# EAGLE design usbspi v1.0 (EAGLE 4.13)
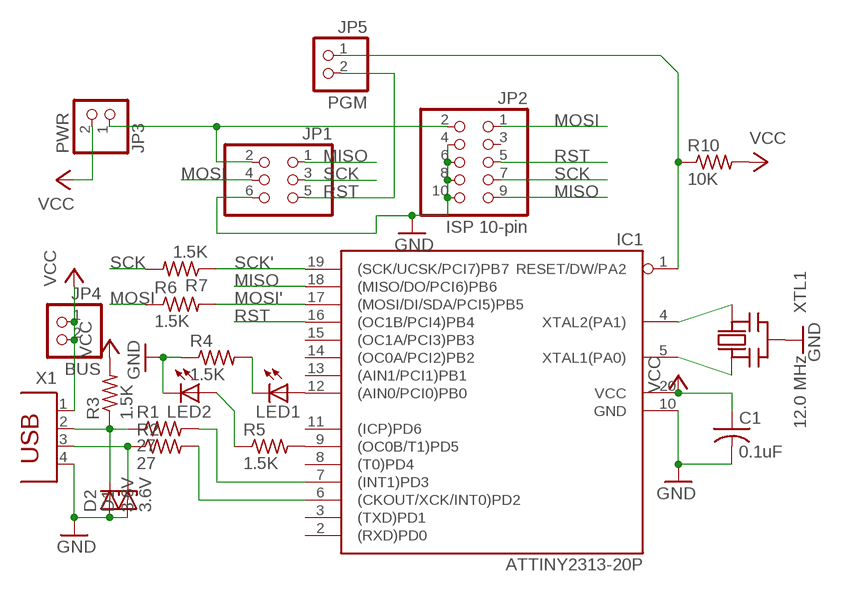
[diagram p0: schematic, sheet 1]

## Parts
C1  0.1uF  C-US025-025X050  [C025-025X050]
D1  3.6V  ZENER-DIODEDO35Z10  [DO35Z10]
D2  3.6V  ZENER-DIODEDO35Z10  [DO35Z10]
IC1  ATTINY2313-20P  [DIL20]
JP1  PINHD-2X3  [2X03]
JP2  ISP 10-pin  PINHD-2X5  [2X05]
JP3  PWR  PINHD-1X2  [1X02]
JP4  BUS  PINHD-1X2  [1X02]
JP5  PGM  PINHD-1X2  [1X02]
LED1  LED3MM  [LED3MM]
LED2  LED3MM  [LED3MM]
R1  27  R-US_0207/10  [0207/10]
R2  27  R-US_0207/10  [0207/10]
R3  1.5K  R-US_0207/10  [0207/10]
R4  1.5K  R-US_0207/5V  [0207/5V]
R5  1.5K  R-US_0207/10  [0207/10]
R6  1.5K  R-US_0207/5V  [0207/5V]
R7  1.5K  R-US_0207/5V  [0207/5V]
R10  10K  R-US_0207/5V  [0207/5V]
X1  PN61729  [PN61729]
XTL1  12.0 MHz  CERMOSCILL  [CERM_OSC]

## Nets
GND: C1.2 D1.A D2.A IC1.10(GND) JP1.6 JP2.4 JP2.6 JP2.8 JP2.10 LED2.K(C) R4.1 X1.4 XTL1.P$2(GND)
MISO: IC1.18((MISO/DO/PCI6)PB6) JP1.1 JP2.9
MOSI: JP1.4 JP2.1 R6.1
MOSI': IC1.17((MOSI/DI/SDA/PCI5)PB5) R6.2
N$1: D2.C R1.1 R3.1 X1.2
N$2: D1.C R2.1 X1.3
N$3: IC1.7((INT1)PD3) R1.2
N$4: IC1.5(XTAL1(PA0)) XTL1.P$3(OUT)
N$5: IC1.4(XTAL2(PA1)) XTL1.P$1(IN)
N$6: IC1.6((CKOUT/XCK/INT0)PD2) R2.2
N$7: IC1.12((AIN0/PCI0)PB0) LED1.A
N$8: LED1.K(C) R4.2
N$9: IC1.1(RESET/DW/PA2) JP5.1 R10.1
N$10: IC1.9((OC0B/T1)PD5) R5.2
N$11: LED2.A R5.1
N$14: JP1.2 JP2.2 JP3.1
RST: IC1.16((OC1B/PCI4)PB4) JP1.5 JP2.5 JP5.2
SCK: JP1.3 JP2.7 R7.2
SCK': IC1.19((SCK/UCSK/PCI7)PB7) R7.1
VCC: C1.1 IC1.20(VCC) JP3.2 JP4.1 JP4.2 R3.2 R10.2 X1.1
Unconnected: IC1.2((RXD)PD0) IC1.3((TXD)PD1) IC1.8((T0)PD4) IC1.11((ICP)PD6) IC1.13((AIN1/PCI1)PB1) IC1.14((OC0A/PCI2)PB2) IC1.15((OC1A/PCI3)PB3) JP2.3

## Library data of the parts
C1 = rcl-ez:C-US: CAPACITOR, American symbol
D1 D2 = diode:ZENER-DIODE: Z-Diode
IC1 = avr:ATTINY2313: MICROCONTROLLER 2 Kbytes FLASH 128 bytes SRAM 128 bytes EEPROM USART USI
JP1 = pinhead-ez:PINHD-2X3: PIN HEADER
JP2 = sonar:PINHD-2X5: PIN HEADER
JP3-JP5 = pinhead:PINHD-1X2: PIN HEADER
LED1 LED2 = minimidi:LED: LED OSRAM: - CHIPLED LG R971, LG N971, LY N971, LG Q971, LY Q971, LO R971, LY R971 LH N974, LH R974 LS Q976, LO Q976, LY Q976 LO Q996 - Hyper CHIPLED LW Q18S LB Q993, LB Q99A, LB R99A - SideLED LS A670, LO A670, LY A670, LG A670, LP A670 LB A673, LV A673, LT A673, LW A673 LH A674 LY A675 LS A676, LA A676, LO A676, LY A676, LW A676 LS A679, LY A679, LG A679 - Hyper Micro SIDELED® LS Y876, LA Y876, LO Y876, LY Y876 LT Y87S - SmartLED LW L88C, LW L88S LB L89C, LB L89S, LG L890 LS L89K, LO L89K, LY L89K LS L896, LA L896, LO L896, LY L896 - TOPLED LS T670, LO T670, LY T670, LG T670, LP T670 LSG T670, LSP T670, LSY T670, LOP T670, LYG T670 LG T671, LOG T671, LSG T671 LB T673, LV T673, LT T673, LW T673 LH T674 LS T676, LA T676, LO T676, LY T676, LB T676, LH T676, LSB T676, LW T676 LB T67C, LV T67C, LT T67C, LS T67K, LO T67K, LY T67K, LW E67C LS E67B, LA E67B, LO E67B, LY E67B, LB E67C, LV E67C, LT E67C LW T67C LS T679, LY T679, LG T679 LS T770, LO T770, LY T770, LG T770, LP T770 LB T773, LV T773, LT T773, LW T773 LH T774 LS E675, LA E675, LY E675, LS T675 LS T776, LA T776, LO T776, LY T776, LB T776 LHGB T686 LT T68C, LB T68C - Hyper Mini TOPLED® LB M676 - Mini TOPLED Santana® LG M470 LS M47K, LO M47K, LY M47K Source: http://www.osram.convergy.de/
R1-R7 R10 = rcl-ez:R-US_: RESISTOR, American symbol
X1 = con-berg-ez:PN61729: BERG USB connector
XTL1 = minimidi:CERMOSCILL

## Board
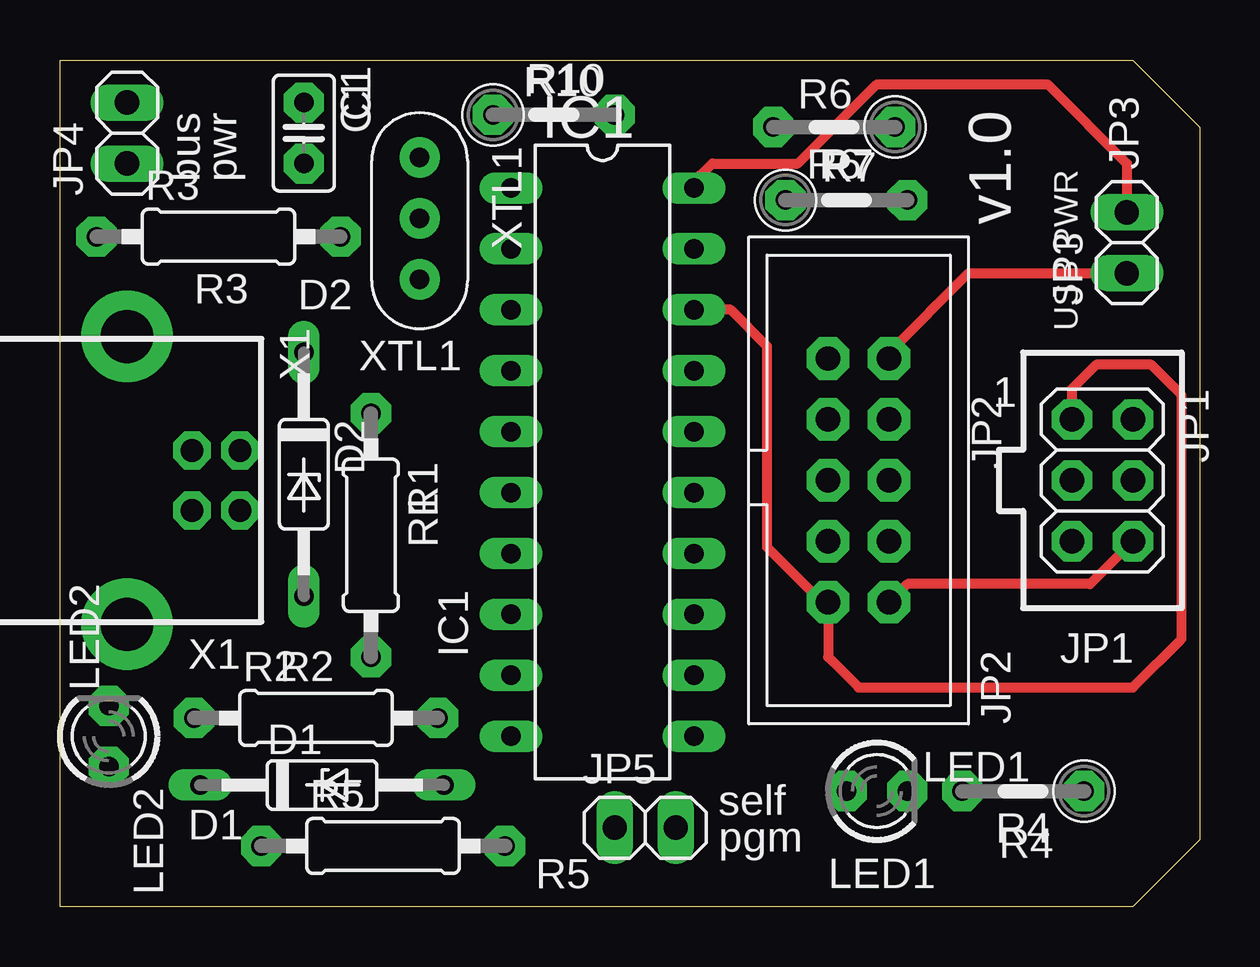
[diagram p1: board, top side]
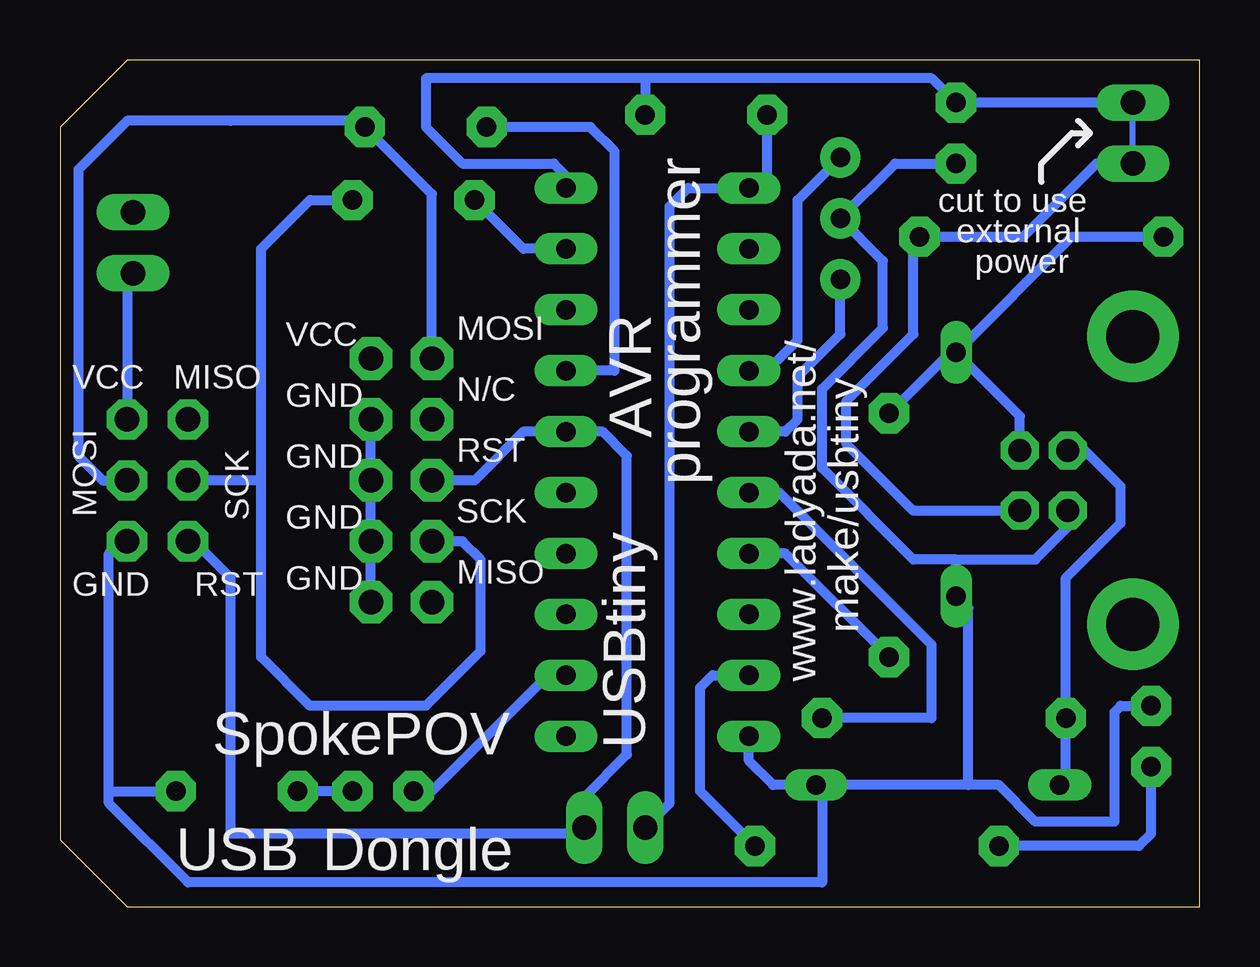
[diagram p2: board, bottom side, seen from below]

Size 47.5 x 35.31 mm. Coordinates in mm from the lower left corner, seen from the top.
Outline: 0,35.31 44.7,35.31 47.5,32.51 47.5,2.79 44.7,0 0,0 0,35.31
Copper layers (1*16): Top 0.035mm / dielectric 1.5mm / Bottom 0.035mm
Design rules "default": minimum track width 10mil, minimum drill 24mil, track to track 16mil, track to pad 16mil, pad to pad 16mil, via to via 16mil, smd to smd 0mil, copper to edge 20mil, drill to drill 8mil, minimum pad ring 10mil, minimum via ring 8mil, stop-mask expansion 4mil, vias tented up to drill 0mil, thermal gap 10mil

### Footprints (pad centres in the part's own frame; a part is rotated, then mirrored left to right if it is on the bottom)
C025-025X050 = drill 0.813 pad 1.676 octagon: 1 -1.27,0; 2 1.27,0
DO35Z10 = drill 0.813 long: A 5.08,0; C -5.08,0
DIL20 = drill 0.813 long: 1 -11.43,-3.81; 2 -8.89,-3.81; 3 -6.35,-3.81; 4 -3.81,-3.81; 5 -1.27,-3.81; 6 1.27,-3.81; 7 3.81,-3.81; 8 6.35,-3.81; 9 8.89,-3.81; 10 11.43,-3.81; 11 11.43,3.81; 12 8.89,3.81; 13 6.35,3.81; 14 3.81,3.81; 15 1.27,3.81; 16 -1.27,3.81; 17 -3.81,3.81; 18 -6.35,3.81; 19 -8.89,3.81; 20 -11.43,3.81
2X03 = drill 1.016 pad 1.676 octagon: 1 -2.54,-1.27; 2 -2.54,1.27; 3 0,-1.27; 4 0,1.27; 5 2.54,-1.27; 6 2.54,1.27
2X05 = drill 1.016 pad 1.778 octagon: 1 -5.08,-1.27; 2 -5.08,1.27; 3 -2.54,-1.27; 4 -2.54,1.27; 5 0,-1.27; 6 0,1.27; 7 2.54,-1.27; 8 2.54,1.27; 9 5.08,-1.27; 10 5.08,1.27
1X02 = drill 1.016 long: 1 -1.27,0; 2 1.27,0
LED3MM = drill 0.813 pad 1.676 octagon: A -1.27,0; K 1.27,0
0207/10 = drill 0.813 pad 1.676 octagon: 1 -5.08,0; 2 5.08,0
0207/5V = drill 0.813 pad 1.676 octagon: 1 -2.54,0; 2 2.54,0
PN61729 = drill 0.95 pad 1.575 octagon: 1 1.25,4.71; 2 -1.25,4.71; 3 -1.25,2.71; 4 1.25,2.71 | drill 2.2 pad 3.81 round: P$1 -6,0; P$2 6,0
CERM_OSC = drill 0.813 pad 1.676 round: P$1 -2.54,0; P$2 0,0; P$3 2.54,0

### Placement (x,y rotation side)
C1  10.16,32.26 270 top
D1  10.92,5.08 0 top
D2  10.16,18.03 270 top
IC1  22.61,18.54 270 top
JP1  43.43,17.78 270 top
JP2  33.27,17.78 270 top
JP3  44.45,27.69 90 top
JP4  2.79,32.26 90 top
JP5  24.38,3.3 0 top
LED1  34.04,4.83 0 top
LED2  2.03,7.11 90 top
R1  12.95,15.49 270 top
R2  10.67,7.87 0 top
R3  6.6,27.94 0 top
R4  40.13,4.83 180 top
R5  13.46,2.54 0 top
R6  32.26,32.51 180 top
R7  32.77,29.46 0 top
R10  20.57,33.02 0 top
X1  2.79,17.78 270 top
XTL1  14.99,28.7 270 top

### Tracks (layer width: path | path; a pad name or v marks a point on that pad's centre or on a via)
GND
  Top 0.406: JP2.10 35.31,13.46 42.93,13.46 JP1.6
  Bottom 0.406: 10.16,14.48 11.94,14.48 15.75,18.29 15.75,21.59 13.21,24.13 13.21,26.92 XTL1.P$2 12.7,30.99 C1.2 | 10.16,14.48 6.86,14.48 5.25,16.09 5.25,16.43 5.35,16.53 X1.4 | 10.16,14.48 D2.A 9.65,12.45 9.65,5.08 | 9.65,5.08 15.75,5.08 | IC1.10 18.8,6.1 17.78,5.08 D1.A 15.75,5.08 | 45.47,4.83 45.47,4.32 42.16,1.02 15.75,1.02 15.75,5.08 | 45.47,4.83 45.47,14.73 44.96,15.24 JP1.6 | JP2.4 JP2.6 34.54,14.99 | JP2.10 34.29,12.7 34.54,12.95 34.54,14.99 | 34.54,14.99 JP2.8 | LED2.K 3.3,8.38 3.56,8.13 3.56,3.56 6.86,3.56 8.38,5.08 9.65,5.08 | 45.47,4.83 R4.1
MISO
  Top 0.406: IC1.18 27.94,24.89 29.46,23.37 29.46,14.99 31.75,12.7 JP2.9 32,10.41 33.27,9.14 44.7,9.14 46.74,11.18 46.74,21.34 45.47,22.61 43.18,22.61 42.16,21.59 JP1.1
MOSI
  Bottom 0.305: JP2.1 31.75,22.86
  Bottom 0.406: 40.39,32.77 35.05,32.77 R6.1 | JP2.1 32,29.72 R6.1 | JP1.4 45.72,17.78 46.74,18.8 46.74,30.73 44.7,32.77 34.8,32.77 R6.1
MOSI'
  Bottom 0.406: R6.2 25.4,32.51 24.38,31.5 24.38,22.35 IC1.17
N$1
  Bottom 0.406: R1.1 10.41,23.11 D2.C | R3.1 5.33,27.94 D2.C | X1.2 7.5,20.46 D2.C
N$2
  Bottom 0.406: D1.C 5.59,5.08 R2.1 5.59,13.72 3.3,16 3.3,17.53 4.81,19.03 5.57,19.03 | 5.57,19.03 X1.3 | 5.57,19.03 5.59,19.05
N$3
  Bottom 0.406: IC1.7 17.27,14.73 R1.2
N$4
  Bottom 0.406: XTL1.P$3 14.99,23.88 16.76,22.1 16.76,20.32 17.27,19.81 IC1.5
N$5
  Bottom 0.406: XTL1.P$1 16.76,29.46 16.76,23.62 18.03,22.35 IC1.4
N$6
  Bottom 0.406: IC1.6 17.53,17.27 11.18,10.92 11.18,7.87 R2.2
N$7
  Bottom 0.406: IC1.12 27.18,9.65 32,4.83 LED1.A
N$8
  Bottom 0.406: LED1.K R4.2
N$9
  Bottom 0.406: JP5.1 22.1,4.32 22.1,29.21 21.34,29.97 IC1.1 18.03,29.97 R10.1
N$10
  Bottom 0.406: IC1.9 20.32,9.65 20.83,9.14 20.83,4.83 R5.2
N$11
  Bottom 0.406: LED2.A 2.03,3.05 2.54,2.54 R5.1
N$14
  Top 0.406: JP2.2 34.54,23.11 37.85,26.42 JP3.1
  Bottom 0.406: JP3.1 44.7,26.42 JP1.2
RST
  Bottom 0.406: 25.65,3.05 25.65,4.57 23.88,6.35 23.88,18.8 24.89,19.81 26.16,19.81 | 25.65,3.05 40.39,3.05 40.39,13.72 41.91,15.24 JP1.5 42.42,15.24 | JP5.2 25.65,3.05 | JP2.5 30.23,17.78 28.19,19.81 26.16,19.81 | 26.16,19.81 IC1.16
SCK
  Bottom 0.406: JP2.7 30.73,15.24 29.97,14.48 29.97,10.67 32.26,8.38 37.08,8.38 39.12,10.41 39.12,17.78 | 39.12,17.78 JP1.3 42.42,17.53 | 39.12,17.78 39.12,27.43 37.08,29.46 R7.2
SCK'
  Bottom 0.406: IC1.19 28.19,27.43 R7.1
VCC
  Top 0.406: JP3.2 44.45,30.99 41.15,34.29 34.04,34.29 30.73,30.99 27.18,30.99 26.42,30.23 IC1.20
  Bottom 0.254: JP4.1 JP4.2
  Bottom 0.406: JP4.1 4.32,30.99 7.37,27.94 R3.2 11.94,27.69 11.94,23.88 14.73,21.08 14.73,19.3 11.94,16.51 7.11,16.51 7.13,16.53 X1.1 | 23.11,34.54 R10.2 | 23.11,34.54 11.18,34.54 C1.1 JP4.2 | 23.11,34.54 32.26,34.54 32.26,32.51 30.73,30.99 26.92,30.99 26.42,30.48 IC1.20

### Text on the board
tPlace: R10 | C1 | R6 | USB PWR | JP3 | bus | pwr | R7 | v1.0 | R3 | D2 | XTL1 | 1 | R1 | X1 | IC1 | JP1 | R2 | JP2 | self | D1 | pgm | R4 | LED2 | R5 | LED1
bPlace: programmer | cut to use | external | power | MOSI | VCC | MISO | VCC | N/C | GND | AVR | RST | SCK | GND | SCK | GND | MOSI | MISO | GND | RST | GND | make/usbtiny | www.ladyada.net/ | USBtiny | SpokePOV | Dongle | USB